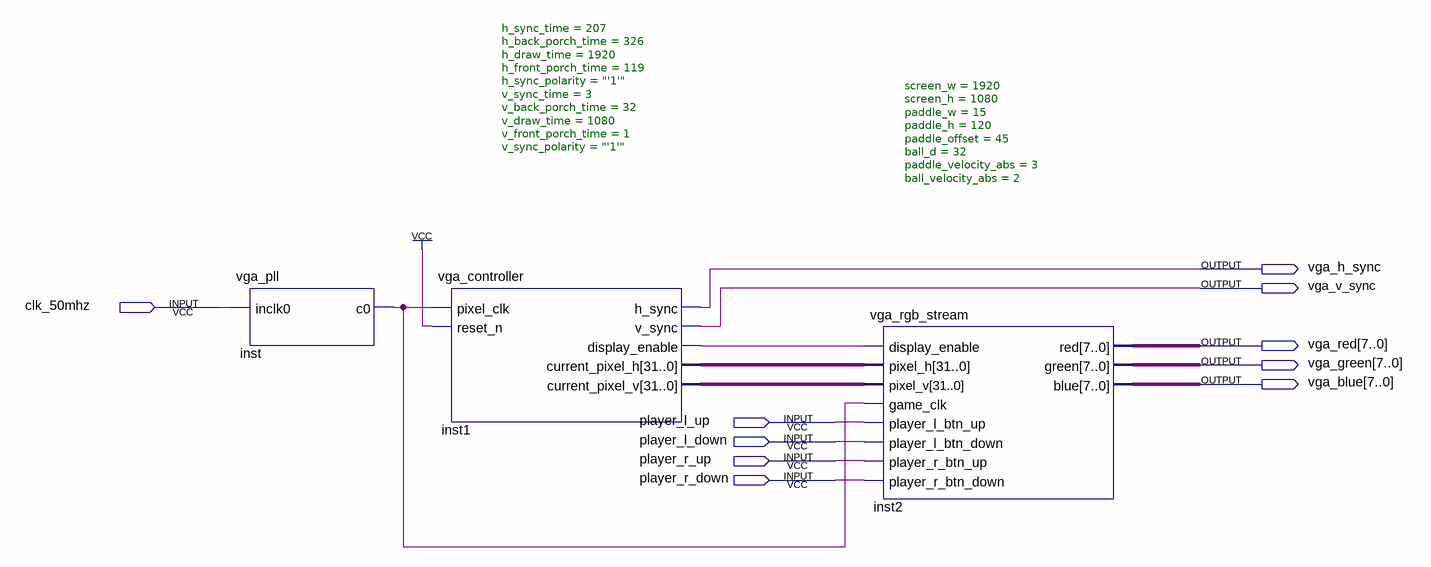
[diagram p0: schematic sheet]
// Quartus schematic vga_top.bdf as structural Verilog: 3 symbols, 10 pins
module vga_top (
  input  clk_50mhz,
  input  player_l_up,
  input  player_l_down,
  input  player_r_up,
  input  player_r_down,
  output vga_h_sync,
  output vga_v_sync,
  output [7:0] vga_red,
  output [7:0] vga_green,
  output [7:0] vga_blue
);

  wire inst1_display_enable, inst_c0;
  wire [31:0] inst1_current_pixel_h, inst1_current_pixel_v;

  vga_pll inst (.inclk0(clk_50mhz), .c0(inst_c0));
  vga_controller #(.h_sync_time(207), .h_back_porch_time(326), .h_draw_time(1920), .h_front_porch_time(119), .h_sync_polarity("'1'"), .v_sync_time(3), .v_back_porch_time(32), .v_draw_time(1080), .v_front_porch_time(1), .v_sync_polarity("'1'")) inst1 (
    .pixel_clk(inst_c0), .reset_n(1'b1), .h_sync(vga_h_sync), .v_sync(vga_v_sync),
    .display_enable(inst1_display_enable), .current_pixel_h(inst1_current_pixel_h),
    .current_pixel_v(inst1_current_pixel_v));
  vga_rgb_stream #(.screen_w(1920), .screen_h(1080), .paddle_w(15), .paddle_h(120), .paddle_offset(45), .ball_d(32), .paddle_velocity_abs(3), .ball_velocity_abs(2)) inst2 (
    .display_enable(inst1_display_enable), .pixel_h(inst1_current_pixel_h), .pixel_v(inst1_current_pixel_v),
    .game_clk(inst_c0), .player_l_btn_up(player_l_up), .player_l_btn_down(player_l_down),
    .player_r_btn_up(player_r_up), .player_r_btn_down(player_r_down), .red(vga_red), .green(vga_green),
    .blue(vga_blue));
endmodule
